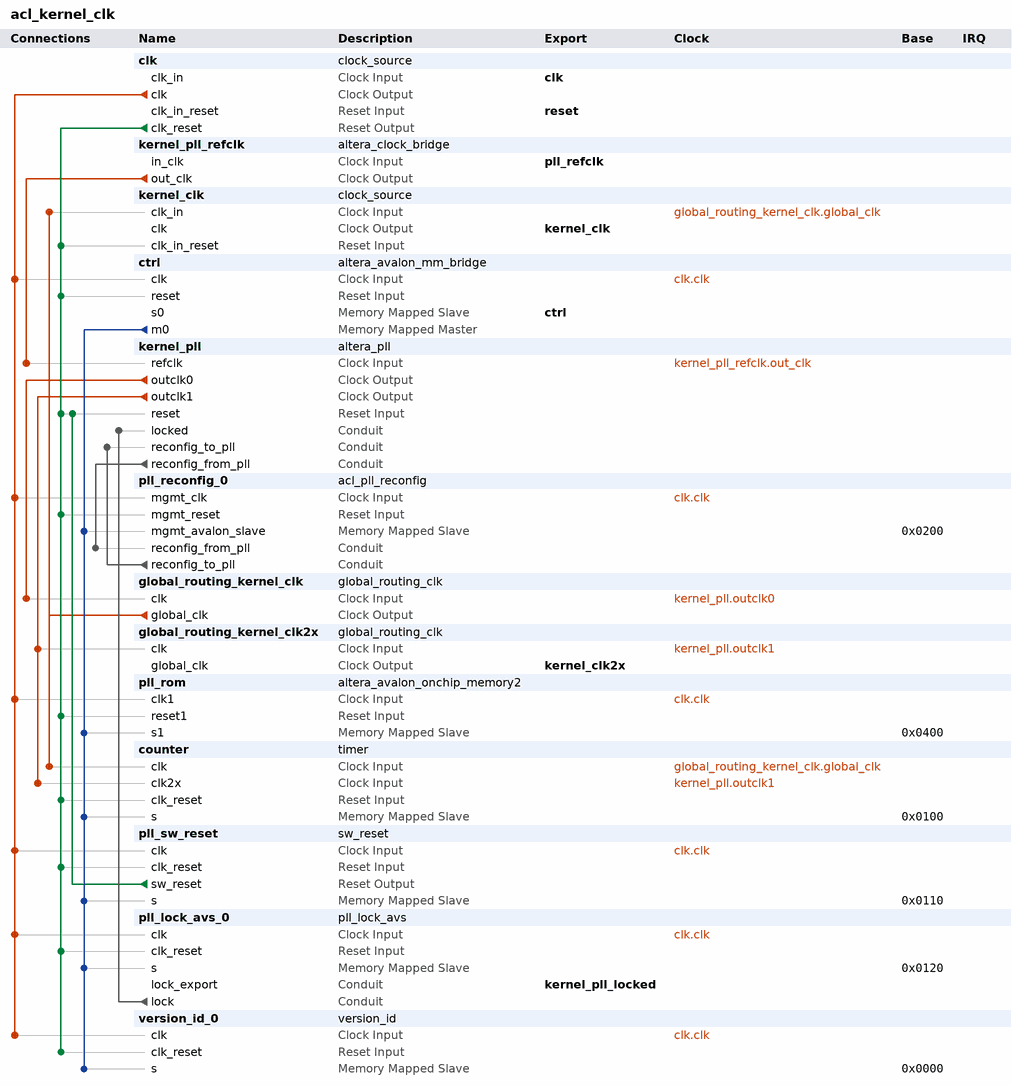
[diagram p0: system contents]
# Platform Designer (Qsys) system acl_kernel_clk, Cyclone IV GX Unknown
# Parameters at their usual value, and those the tool derives, are not listed.
package require -exact qsys 14.1
create_system acl_kernel_clk
set_project_property DEVICE_FAMILY {Cyclone IV GX}
set_project_property DEVICE Unknown

add_instance clk clock_source 14.1
set_instance_parameter_value clk clockFrequency 50000000
set_instance_parameter_value clk resetSynchronousEdges DEASSERT

add_instance kernel_pll_refclk altera_clock_bridge 14.1
set_instance_parameter_value kernel_pll_refclk DERIVED_CLOCK_RATE 0
set_instance_parameter_value kernel_pll_refclk EXPLICIT_CLOCK_RATE 0

add_instance kernel_clk clock_source 14.1
set_instance_parameter_value kernel_clk clockFrequency 100000000

add_instance ctrl altera_avalon_mm_bridge 14.1
set_instance_parameter_value ctrl ADDRESS_UNITS SYMBOLS
set_instance_parameter_value ctrl ADDRESS_WIDTH 11
set_instance_parameter_value ctrl DATA_WIDTH 32
set_instance_parameter_value ctrl MAX_PENDING_RESPONSES 4
set_instance_parameter_value ctrl PIPELINE_COMMAND 0
set_instance_parameter_value ctrl PIPELINE_RESPONSE 0
set_instance_parameter_value ctrl USE_AUTO_ADDRESS_WIDTH 0

add_instance kernel_pll altera_pll 14.1
set_instance_parameter_value kernel_pll gui_device_speed_grade 2
set_instance_parameter_value kernel_pll gui_en_reconf true
set_instance_parameter_value kernel_pll gui_fractional_cout 24
set_instance_parameter_value kernel_pll gui_number_of_clocks 2
set_instance_parameter_value kernel_pll gui_operation_mode direct
set_instance_parameter_value kernel_pll gui_output_clock_frequency0 140.0
set_instance_parameter_value kernel_pll gui_output_clock_frequency1 280.0
set_instance_parameter_value kernel_pll gui_pll_mode {Fractional-N PLL}
set_instance_parameter_value kernel_pll gui_reference_clock_frequency 50.0
set_instance_parameter_value kernel_pll gui_use_locked true

add_instance pll_reconfig_0 acl_pll_reconfig 12.1
set_instance_parameter_value pll_reconfig_0 ENABLE_MIF 0
set_instance_parameter_value pll_reconfig_0 device_family {Cyclone IV GX}
set_instance_parameter_value pll_reconfig_0 reconf_width 64

add_instance global_routing_kernel_clk global_routing_clk 10.0

add_instance global_routing_kernel_clk2x global_routing_clk 10.0

add_instance pll_rom altera_avalon_onchip_memory2 14.1
set_instance_parameter_value pll_rom dataWidth 32
set_instance_parameter_value pll_rom dualPort false
set_instance_parameter_value pll_rom initMemContent true
set_instance_parameter_value pll_rom initializationFileName pll_rom
set_instance_parameter_value pll_rom instanceID PLLM
set_instance_parameter_value pll_rom memorySize 1024
set_instance_parameter_value pll_rom slave1Latency 2
set_instance_parameter_value pll_rom useNonDefaultInitFile true
set_instance_parameter_value pll_rom writable false

add_instance counter timer 10.0
set_instance_parameter_value counter WIDTH 32

add_instance pll_sw_reset sw_reset 10.0
set_instance_parameter_value pll_sw_reset LOG2_RESET_CYCLES 10
set_instance_parameter_value pll_sw_reset WIDTH 32

add_instance pll_lock_avs_0 pll_lock_avs 10.0
set_instance_parameter_value pll_lock_avs_0 WIDTH 32

add_instance version_id_0 version_id 10.0
set_instance_parameter_value version_id_0 VERSION_ID -1598029823
set_instance_parameter_value version_id_0 WIDTH 32

# connections
add_connection clk.clk ctrl.clk clock
add_connection clk.clk pll_lock_avs_0.clk clock
add_connection clk.clk pll_reconfig_0.mgmt_clk clock
add_connection clk.clk pll_rom.clk1 clock
add_connection clk.clk pll_sw_reset.clk clock
add_connection clk.clk version_id_0.clk clock
add_connection global_routing_kernel_clk.global_clk counter.clk clock
add_connection global_routing_kernel_clk.global_clk kernel_clk.clk_in clock
add_connection kernel_pll.outclk0 global_routing_kernel_clk.clk clock
add_connection kernel_pll.outclk1 counter.clk2x clock
add_connection kernel_pll.outclk1 global_routing_kernel_clk2x.clk clock
add_connection kernel_pll_refclk.out_clk kernel_pll.refclk clock
add_connection clk.clk_reset counter.clk_reset reset
add_connection clk.clk_reset ctrl.reset reset
add_connection clk.clk_reset kernel_clk.clk_in_reset reset
add_connection clk.clk_reset kernel_pll.reset reset
add_connection clk.clk_reset pll_lock_avs_0.clk_reset reset
add_connection clk.clk_reset pll_reconfig_0.mgmt_reset reset
add_connection clk.clk_reset pll_rom.reset1 reset
add_connection clk.clk_reset pll_sw_reset.clk_reset reset
add_connection clk.clk_reset version_id_0.clk_reset reset
add_connection pll_sw_reset.sw_reset kernel_pll.reset reset
add_connection ctrl.m0 counter.s avalon
set_connection_parameter_value ctrl.m0/counter.s baseAddress 0x0100
add_connection ctrl.m0 pll_lock_avs_0.s avalon
set_connection_parameter_value ctrl.m0/pll_lock_avs_0.s baseAddress 0x0120
add_connection ctrl.m0 pll_reconfig_0.mgmt_avalon_slave avalon
set_connection_parameter_value ctrl.m0/pll_reconfig_0.mgmt_avalon_slave baseAddress 0x0200
add_connection ctrl.m0 pll_rom.s1 avalon
set_connection_parameter_value ctrl.m0/pll_rom.s1 baseAddress 0x0400
add_connection ctrl.m0 pll_sw_reset.s avalon
set_connection_parameter_value ctrl.m0/pll_sw_reset.s baseAddress 0x0110
add_connection ctrl.m0 version_id_0.s avalon
set_connection_parameter_value ctrl.m0/version_id_0.s baseAddress 0x0000
add_connection kernel_pll.reconfig_from_pll pll_reconfig_0.reconfig_from_pll conduit
add_connection pll_lock_avs_0.lock kernel_pll.locked conduit
add_connection pll_reconfig_0.reconfig_to_pll kernel_pll.reconfig_to_pll conduit

# exported interfaces
add_interface clk clock sink
set_interface_property clk EXPORT_OF clk.clk_in
add_interface ctrl avalon slave
set_interface_property ctrl EXPORT_OF ctrl.s0
add_interface kernel_clk clock source
set_interface_property kernel_clk EXPORT_OF kernel_clk.clk
add_interface kernel_clk2x clock source
set_interface_property kernel_clk2x EXPORT_OF global_routing_kernel_clk2x.global_clk
add_interface kernel_pll_locked conduit end
set_interface_property kernel_pll_locked EXPORT_OF pll_lock_avs_0.lock_export
add_interface pll_refclk clock sink
set_interface_property pll_refclk EXPORT_OF kernel_pll_refclk.in_clk
add_interface reset reset sink
set_interface_property reset EXPORT_OF clk.clk_in_reset

set_interconnect_requirement {$system} qsys_mm.clockCrossingAdapter HANDSHAKE
set_interconnect_requirement {$system} qsys_mm.maxAdditionalLatency 1

save_system acl_kernel_clk.qsys
